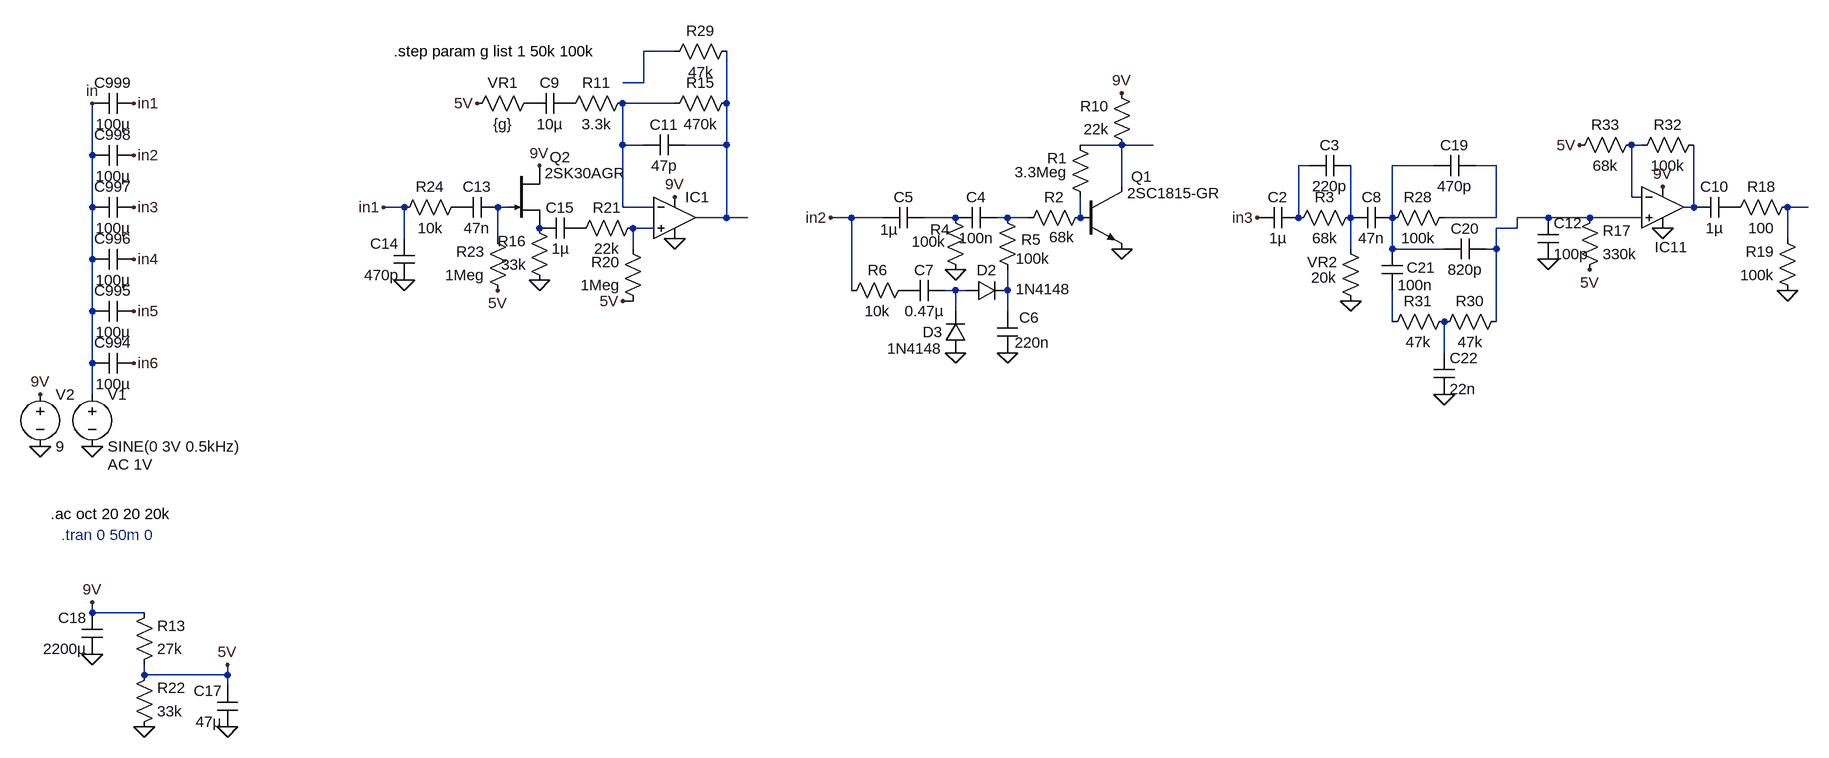
[diagram p0: schematic hm1.asc]
hm1.asc, the LTspice schematic file:
Version 4
SHEET 1 4260 4108
WIRE -2816 1296 -2864 1296
WIRE -2864 1344 -2864 1296
WIRE -2864 1344 -2896 1344
WIRE -2816 1376 -2896 1376
WIRE -2736 1376 -2736 1296
WIRE -2896 1440 -2896 1376
WIRE -2864 1440 -2896 1440
WIRE -2736 1440 -2736 1376
WIRE -2736 1440 -2800 1440
WIRE -2128 1440 -2192 1440
WIRE -2080 1440 -2128 1440
WIRE -1328 1440 -1344 1440
WIRE -3712 1456 -3712 1376
WIRE -1840 1472 -1856 1472
WIRE -1648 1472 -1712 1472
WIRE -1552 1472 -1584 1472
WIRE -2128 1504 -2128 1440
WIRE -1344 1520 -1344 1440
WIRE -1328 1520 -1344 1520
WIRE -3712 1536 -3712 1456
WIRE -3232 1536 -3264 1536
WIRE -3072 1536 -3088 1536
WIRE -2896 1536 -2896 1440
WIRE -2848 1536 -2896 1536
WIRE -1248 1536 -1248 1440
WIRE -1248 1536 -1264 1536
WIRE -1072 1536 -1104 1536
WIRE -2736 1552 -2736 1440
WIRE -2736 1552 -2784 1552
WIRE -2704 1552 -2736 1552
WIRE -2544 1552 -2576 1552
WIRE -2496 1552 -2544 1552
WIRE -2384 1552 -2432 1552
WIRE -2304 1552 -2320 1552
WIRE -2272 1552 -2304 1552
WIRE -2192 1552 -2192 1520
WIRE -1856 1552 -1856 1472
WIRE -1776 1552 -1776 1472
WIRE -1712 1552 -1712 1472
WIRE -1552 1552 -1552 1472
WIRE -1552 1552 -1632 1552
WIRE -1472 1552 -1520 1552
WIRE -1408 1552 -1472 1552
WIRE -1328 1552 -1408 1552
WIRE -2848 1568 -2880 1568
WIRE -1520 1568 -1520 1552
WIRE -1520 1568 -1552 1568
WIRE -3232 1584 -3232 1536
WIRE -3088 1584 -3088 1536
WIRE -1104 1584 -1104 1536
WIRE -2880 1600 -2880 1568
WIRE -1776 1600 -1776 1552
WIRE -1712 1600 -1712 1552
WIRE -1632 1600 -1712 1600
WIRE -1552 1600 -1552 1568
WIRE -1552 1600 -1568 1600
WIRE -3712 1616 -3712 1536
WIRE -2544 1664 -2544 1552
WIRE -2384 1664 -2400 1664
WIRE -2368 1664 -2384 1664
WIRE -2304 1664 -2304 1632
WIRE -2880 1680 -2896 1680
WIRE -3712 1696 -3712 1616
WIRE -2384 1696 -2384 1664
WIRE -2304 1696 -2304 1664
WIRE -1712 1712 -1712 1664
WIRE -1552 1712 -1552 1600
WIRE -1632 1760 -1632 1712
WIRE -3712 1776 -3712 1696
WIRE -3712 1824 -3712 1776
WIRE -3712 2160 -3712 2144
WIRE -3632 2160 -3712 2160
WIRE -3632 2256 -3632 2240
WIRE -3504 2256 -3504 2240
WIRE -3504 2256 -3632 2256
WIRE -3504 2272 -3504 2256
FLAG -3712 2224 0
FLAG -3632 2336 0
FLAG -3504 2336 0
FLAG -3504 2240 5V
FLAG -3712 2144 9V
FLAG -3712 1904 0
FLAG -3712 1376 in
FLAG -3792 1904 0
FLAG -3792 1824 9V
FLAG -3648 1376 in1
FLAG -3648 1456 in2
FLAG -3648 1536 in3
FLAG -3648 1616 in4
FLAG -3648 1696 in5
FLAG -3648 1776 in6
FLAG -2816 1520 9V
FLAG -3024 1648 0
FLAG -2816 1584 0
FLAG -3088 1664 5V
FLAG -2896 1680 5V
FLAG -3120 1376 5V
FLAG -3024 1472 9V
FLAG -3264 1536 in1
FLAG -1296 1504 9V
FLAG -1296 1568 0
FLAG -1408 1632 5V
FLAG -3232 1648 0
FLAG -2384 1760 0
FLAG -2304 1760 0
FLAG -2384 1632 0
FLAG -2128 1360 9V
FLAG -2128 1600 0
FLAG -2576 1552 in2
FLAG -1776 1680 0
FLAG -1632 1824 0
FLAG -1472 1616 0
FLAG -1424 1440 5V
FLAG -1104 1664 0
FLAG -1920 1552 in3
SYMBOL cap -3696 2224 R180
WINDOW 0 24 56 Left 2
WINDOW 3 24 8 Left 2
SYMATTR InstName C18
SYMATTR Value 2200µ
SYMBOL res -3648 2256 M180
WINDOW 0 36 76 Left 2
WINDOW 3 36 40 Left 2
SYMATTR InstName R13
SYMATTR Value 27k
SYMBOL res -3648 2352 M180
WINDOW 0 36 76 Left 2
WINDOW 3 36 40 Left 2
SYMATTR InstName R22
SYMATTR Value 33k
SYMBOL cap -3488 2336 R180
WINDOW 0 24 56 Left 2
WINDOW 3 24 8 Left 2
SYMATTR InstName C17
SYMATTR Value 47µ
SYMBOL voltage -3712 1808 R0
WINDOW 123 24 124 Left 2
WINDOW 39 0 0 Left 2
SYMATTR Value2 AC 1V
SYMATTR InstName V1
SYMATTR Value SINE(0 3V 0.5kHz)
SYMBOL voltage -3792 1808 R0
WINDOW 123 0 0 Left 0
WINDOW 39 0 0 Left 0
SYMATTR InstName V2
SYMATTR Value 9
SYMBOL cap -3648 1440 R90
WINDOW 0 0 32 VBottom 2
WINDOW 3 32 32 VTop 2
SYMATTR InstName C998
SYMATTR Value 100µ
SYMBOL cap -3648 1520 R90
WINDOW 0 0 32 VBottom 2
WINDOW 3 32 32 VTop 2
SYMATTR InstName C997
SYMATTR Value 100µ
SYMBOL cap -3648 1600 R90
WINDOW 0 0 32 VBottom 2
WINDOW 3 32 32 VTop 2
SYMATTR InstName C996
SYMATTR Value 100µ
SYMBOL cap -3648 1360 R90
WINDOW 0 0 32 VBottom 2
WINDOW 3 32 32 VTop 2
SYMATTR InstName C999
SYMATTR Value 100µ
SYMBOL cap -3648 1680 R90
WINDOW 0 0 32 VBottom 2
WINDOW 3 32 32 VTop 2
SYMATTR InstName C995
SYMATTR Value 100µ
SYMBOL cap -3648 1760 R90
WINDOW 0 0 32 VBottom 2
WINDOW 3 32 32 VTop 2
SYMATTR InstName C994
SYMATTR Value 100µ
SYMBOL cap -3088 1520 R90
WINDOW 0 0 32 VBottom 2
WINDOW 3 32 32 VTop 2
SYMATTR InstName C13
SYMATTR Value 47n
SYMBOL res -3136 1520 R90
WINDOW 0 0 56 VBottom 2
WINDOW 3 32 56 VTop 2
SYMATTR InstName R24
SYMATTR Value 10k
SYMBOL res -3072 1680 R180
WINDOW 0 36 76 Left 2
WINDOW 3 36 40 Left 2
SYMATTR InstName R23
SYMATTR Value 1Meg
SYMBOL res -3008 1664 R180
WINDOW 0 36 76 Left 2
WINDOW 3 36 40 Left 2
SYMATTR InstName R16
SYMATTR Value 33k
SYMBOL cap -2960 1552 R90
WINDOW 0 0 32 VBottom 2
WINDOW 3 32 32 VTop 2
SYMATTR InstName C15
SYMATTR Value 1µ
SYMBOL res -2992 1392 R270
WINDOW 0 32 56 VTop 2
WINDOW 3 0 56 VBottom 2
SYMATTR InstName R11
SYMATTR Value 3.3k
SYMBOL res -2864 1696 R180
WINDOW 0 36 76 Left 2
WINDOW 3 36 40 Left 2
SYMATTR InstName R20
SYMATTR Value 1Meg
SYMBOL cap -2976 1360 R90
WINDOW 0 0 32 VBottom 2
WINDOW 3 32 32 VTop 2
SYMATTR InstName C9
SYMATTR Value 10µ
SYMBOL cap -2800 1424 R90
WINDOW 0 0 32 VBottom 2
WINDOW 3 32 32 VTop 2
SYMATTR InstName C11
SYMATTR Value 47p
SYMBOL res -2720 1360 R90
WINDOW 0 0 56 VBottom 2
WINDOW 3 32 56 VTop 2
SYMATTR InstName R15
SYMATTR Value 470k
SYMBOL diode -2368 1760 R180
WINDOW 0 36 32 Left 2
WINDOW 3 36 7 Left 2
SYMATTR InstName D3
SYMATTR Value 1N4148
SYMBOL diode -2368 1680 R270
WINDOW 0 32 32 VTop 2
WINDOW 3 34 119 VBottom 2
SYMATTR InstName D2
SYMATTR Value 1N4148
SYMBOL res -2176 1536 R90
WINDOW 0 0 56 VBottom 2
WINDOW 3 30 44 VTop 2
SYMATTR InstName R2
SYMATTR Value 68k
SYMBOL res -2176 1536 R180
WINDOW 0 36 76 Left 2
WINDOW 3 36 54 Left 2
SYMATTR InstName R1
SYMATTR Value 3.3Meg
SYMBOL res -1232 1424 R90
WINDOW 0 0 56 VBottom 2
WINDOW 3 32 56 VTop 2
SYMATTR InstName R32
SYMATTR Value 100k
SYMBOL cap -1856 1536 R90
WINDOW 0 0 32 VBottom 2
WINDOW 3 32 32 VTop 2
SYMATTR InstName C2
SYMATTR Value 1µ
SYMBOL res -2112 1456 R180
WINDOW 0 36 76 Left 2
WINDOW 3 36 40 Left 2
SYMATTR InstName R10
SYMATTR Value 22k
SYMBOL njf -3072 1472 R0
WINDOW 0 64 -13 Left 2
WINDOW 3 56 11 Left 2
SYMATTR InstName Q2
SYMATTR Value 2SK30AGR
SYMBOL npn -2192 1504 R0
WINDOW 0 78 -15 Left 2
WINDOW 3 72 10 Left 2
SYMATTR InstName Q1
SYMATTR Value 2SC1815-GR
SYMBOL cap -3216 1648 R180
WINDOW 0 24 56 Left 2
WINDOW 3 24 8 Left 2
SYMATTR InstName C14
SYMATTR Value 470p
SYMBOL res -2864 1552 R90
WINDOW 0 0 56 VBottom 2
WINDOW 3 32 56 VTop 2
SYMATTR InstName R21
SYMATTR Value 22k
SYMBOL res -2832 1312 R270
WINDOW 0 32 56 VTop 2
WINDOW 3 0 56 VBottom 2
SYMATTR InstName R29
SYMATTR Value 47k
SYMBOL res -3024 1360 R90
WINDOW 0 0 56 VBottom 2
WINDOW 3 32 56 VTop 2
SYMATTR InstName VR1
SYMATTR Value {g}
SYMBOL res -2448 1648 R90
WINDOW 0 0 56 VBottom 2
WINDOW 3 32 56 VTop 2
SYMATTR InstName R6
SYMATTR Value 10k
SYMBOL cap -2400 1648 R90
WINDOW 0 0 32 VBottom 2
WINDOW 3 32 32 VTop 2
SYMATTR InstName C7
SYMATTR Value 0.47µ
SYMBOL cap -2288 1760 R180
WINDOW 0 -33 54 Left 2
WINDOW 3 -49 16 Left 2
SYMATTR InstName C6
SYMATTR Value 220n
SYMBOL res -2288 1648 R180
WINDOW 0 -36 62 Left 2
WINDOW 3 -49 33 Left 2
SYMATTR InstName R5
SYMATTR Value 100k
SYMBOL cap -2432 1536 R90
WINDOW 0 0 32 VBottom 2
WINDOW 3 19 54 VTop 2
SYMATTR InstName C5
SYMATTR Value 1µ
SYMBOL res -2368 1648 R180
WINDOW 0 24 78 Left 2
WINDOW 3 31 59 Left 2
SYMATTR InstName R4
SYMATTR Value 100k
SYMBOL cap -2320 1536 R90
WINDOW 0 0 32 VBottom 2
WINDOW 3 32 32 VTop 2
SYMATTR InstName C4
SYMATTR Value 100n
SYMBOL cap -1776 1456 R90
WINDOW 0 0 32 VBottom 2
WINDOW 3 32 32 VTop 2
SYMATTR InstName C3
SYMATTR Value 220p
SYMBOL res -1760 1536 R90
WINDOW 0 0 56 VBottom 2
WINDOW 3 32 56 VTop 2
SYMATTR InstName R3
SYMATTR Value 68k
SYMBOL res -1760 1696 R180
WINDOW 0 36 76 Left 2
WINDOW 3 38 52 Left 2
SYMATTR InstName VR2
SYMATTR Value 20k
SYMBOL cap -1584 1456 R90
WINDOW 0 0 32 VBottom 2
WINDOW 3 32 32 VTop 2
SYMATTR InstName C19
SYMATTR Value 470p
SYMBOL res -1616 1536 R90
WINDOW 0 0 56 VBottom 2
WINDOW 3 32 56 VTop 2
SYMATTR InstName R28
SYMATTR Value 100k
SYMBOL cap -1728 1664 M180
WINDOW 0 38 35 Left 2
WINDOW 3 24 8 Left 2
SYMATTR InstName C21
SYMATTR Value 100n
SYMBOL res -1616 1696 R90
WINDOW 0 0 56 VBottom 2
WINDOW 3 32 56 VTop 2
SYMATTR InstName R31
SYMATTR Value 47k
SYMBOL res -1536 1696 R90
WINDOW 0 0 56 VBottom 2
WINDOW 3 32 56 VTop 2
SYMATTR InstName R30
SYMATTR Value 47k
SYMBOL cap -1648 1824 M180
WINDOW 0 24 56 Left 2
WINDOW 3 24 8 Left 2
SYMATTR InstName C22
SYMATTR Value 22n
SYMBOL cap -1488 1616 M180
WINDOW 0 24 56 Left 2
WINDOW 3 24 8 Left 2
SYMATTR InstName C12
SYMATTR Value 100p
SYMBOL res -1424 1648 M180
WINDOW 0 36 76 Left 2
WINDOW 3 36 40 Left 2
SYMATTR InstName R17
SYMATTR Value 330k
SYMBOL res -1328 1424 R90
WINDOW 0 0 56 VBottom 2
WINDOW 3 32 56 VTop 2
SYMATTR InstName R33
SYMATTR Value 68k
SYMBOL cap -1568 1584 R90
WINDOW 0 0 32 VBottom 2
WINDOW 3 32 32 VTop 2
SYMATTR InstName C20
SYMATTR Value 820p
SYMBOL cap -1184 1520 R90
WINDOW 0 0 32 VBottom 2
WINDOW 3 32 32 VTop 2
SYMATTR InstName C10
SYMATTR Value 1µ
SYMBOL res -1088 1520 R90
WINDOW 0 0 56 VBottom 2
WINDOW 3 32 56 VTop 2
SYMATTR InstName R18
SYMATTR Value 100
SYMBOL res -1088 1680 R180
WINDOW 0 36 76 Left 2
WINDOW 3 36 40 Left 2
SYMATTR InstName R19
SYMATTR Value 100k
SYMBOL cap -1712 1536 R90
WINDOW 0 0 32 VBottom 2
WINDOW 3 32 32 VTop 2
SYMATTR InstName C8
SYMATTR Value 47n
SYMBOL Opamps\\UniversalOpamp2 -2816 1552 R0
SYMATTR InstName IC1
SYMBOL Opamps\\UniversalOpamp2 -1296 1536 R0
WINDOW 0 -12 61 Left 2
SYMATTR InstName IC11
TEXT -3776 2008 Left 2 !.ac oct 20 20 20k
TEXT -3760 2040 Left 2 ;.tran 0 50m 0
TEXT -3248 1296 Left 2 !.step param g list 1 50k 100k

The netlist it stands for:
* hm1.asc
C18 0 9V 2200µ
R13 5V 9V 27k
R22 0 5V 33k
C17 0 5V 47µ
V1 in 0 SINE(0 3V 0.5kHz) AC 1V
V2 9V 0 9
C998 in2 in 100µ
C997 in3 in 100µ
C996 in4 in 100µ
C999 in1 in 100µ
C995 in5 in 100µ
C994 in6 in 100µ
C13 N009 P001 47n
R24 P001 in1 10k
R23 5V N009 1Meg
R16 0 P002 33k
C15 P003 P002 1µ
R11 P004 N002 3.3k
R20 5V N017 1Meg
C9 P004 P005 10µ
C11 N003 N002 47p
R15 N003 N002 470k
D3 0 N018 1N4148
D2 N018 N019 1N4148
R2 N014 N013 68k
R1 N014 N004 3.3Meg
R32 N010 N005 100k
C2 N006 in3 1µ
R10 N004 9V 22k
J§Q2 9V N009 P002 2SK30AGR
Q1 N004 N014 0 0 2SC1815-GR
C14 0 in1 470p
R21 N017 P003 22k
R29 N001 N003 47k
R§VR1 P005 5V {g}
R6 P006 in2 10k
C7 N018 P006 0.47µ
C6 0 N019 220n
R5 N019 N013 100k
C5 N012 in2 1µ
R4 0 N012 100k
C4 N013 N012 100n
C3 N015 N006 220p
R3 N015 N006 68k
R§VR2 0 N015 20k
C19 N008 N007 470p
R28 N008 N007 100k
C21 N020 N007 100n
R31 N021 N020 47k
R30 N016 N021 47k
C22 0 N021 22n
C12 0 N016 100p
R17 5V N016 330k
R33 N005 5V 68k
C20 N016 N007 820p
C10 P007 N010 1µ
R18 N011 P007 100
R19 0 N011 100k
C8 N007 N015 47n
XIC1 N017 N002 9V 0 N003 level.2 Avol=1Meg GBW=10Meg Slew=10Meg ilimit=25m rail=0 Vos=0 phimargin=45 en=0 enk=0 in=0 ink=0 Rin=500Meg  ; pins IN+ IN- V+ V- OUT
XIC11 N016 N005 9V 0 N010 level.2 Avol=1Meg GBW=10Meg Slew=10Meg ilimit=25m rail=0 Vos=0 phimargin=45 en=0 enk=0 in=0 ink=0 Rin=500Meg  ; pins IN+ IN- V+ V- OUT
.model D D
.lib standard.dio
.model NPN NPN
.model PNP PNP
.lib standard.bjt
.model NJF NJF
.model PJF PJF
.lib standard.jft
.ac oct 20 20 20k
* .tran 0 50m 0
.step param g list 1 50k 100k
.lib UniversalOpamps2.sub
.backanno
.end